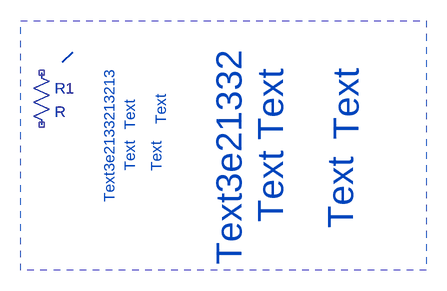
[diagram p0: schematic 14 - Vertical Text.asc]
14 - Vertical Text.asc, the LTspice schematic file:
Version 4.1
SHEET 1 880 680
WIRE -400 256 -384 240
SYMBOL res -448 256 R0
SYMATTR InstName R1
TEXT -328 472 VLeft 2 ;Text3e2133213213
TEXT -296 360 VLeft 2 ;Text
TEXT -296 376 VRight 2 ;Text
TEXT -264 328 VTop 2 ;Text
TEXT -240 400 VBottom 2 ;Text
TEXT -144 568 VLeft 5 ;Text3e21332
TEXT -80 376 VLeft 5 ;Text
TEXT -80 392 VRight 5 ;Text
TEXT 0 320 VTop 5 ;Text
TEXT 64 456 VBottom 5 ;Text
RECTANGLE Normal 160 576 -464 192 2

The netlist it stands for:
* 14 - Vertical Text.asc
R1 NC_01 NC_02 R
* Text3e2133213213
* Text
* Text
* Text
* Text
* Text3e21332
* Text
* Text
* Text
* Text
.backanno
.end